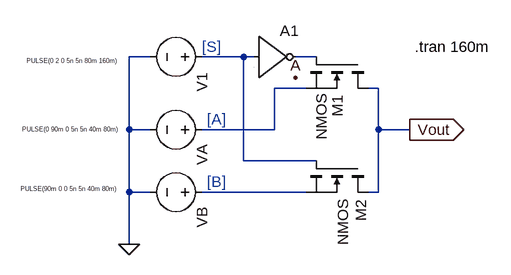
[diagram p0: schematic VLSI_LabInSem.asc]
VLSI_LabInSem.asc, the LTspice schematic file:
Version 4
SHEET 1 880 680
WIRE -64 80 -96 80
WIRE 80 80 16 80
WIRE 96 80 80 80
WIRE 192 80 160 80
WIRE 176 128 128 128
WIRE 288 128 272 128
WIRE -96 192 -96 80
WIRE -64 192 -96 192
WIRE 128 192 128 128
WIRE 128 192 16 192
WIRE 288 192 288 128
WIRE 336 192 288 192
WIRE 80 240 80 80
WIRE 192 240 80 240
WIRE -96 288 -96 192
WIRE -64 288 -96 288
WIRE 176 288 16 288
WIRE 288 288 288 192
WIRE 288 288 272 288
WIRE -96 368 -96 288
FLAG 336 192 Vout
IOPIN 336 192 Out
FLAG -96 368 0
FLAG 160 112 A
SYMBOL nmos 272 80 R90
WINDOW 0 59 47 Left 2
SYMATTR InstName M1
SYMBOL nmos 272 240 R90
WINDOW 0 60 11 Left 2
WINDOW 3 58 39 Left 2
SYMATTR InstName M2
SYMBOL Digital\\inv 96 16 R0
SYMATTR InstName A1
SYMBOL voltage 32 80 R90
WINDOW 3 6 145 VRight 0
WINDOW 123 0 0 Left 0
WINDOW 39 0 0 Left 0
SYMATTR Value PULSE(0 2 0 5n 5n 80m 160m)
SYMATTR InstName V1
SYMBOL voltage 32 288 R90
WINDOW 123 0 0 Left 0
WINDOW 39 0 0 Left 0
WINDOW 3 -5 146 VRight 0
SYMATTR InstName VB
SYMATTR Value PULSE(90m 0 0 5n 5n 40m 80m)
SYMBOL voltage 32 192 R90
WINDOW 123 0 0 Left 0
WINDOW 39 0 0 Left 0
WINDOW 3 -1 144 VRight 0
SYMATTR InstName VA
SYMATTR Value PULSE(0 90m 0 5n 5n 40m 80m)
TEXT 344 64 Left 2 !.tran 160m
TEXT 16 64 Left 2 ;[S]
TEXT 24 176 Left 2 ;[A]
TEXT 24 272 Left 2 ;[B]

The netlist it stands for:
* VLSI_LabInSem.asc
M1 Vout N002 N003 N003 NMOS
M2 Vout N001 N004 N004 NMOS
A1 N001 0 0 0 0 N002 0 0 BUF
V1 N001 0 PULSE(0 2 0 5n 5n 80m 160m)
VB N004 0 PULSE(90m 0 0 5n 5n 40m 80m)
VA N003 0 PULSE(0 90m 0 5n 5n 40m 80m)
.model NMOS NMOS
.model PMOS PMOS
.lib standard.mos
.tran 160m
* [S]
* [A]
* [B]
.backanno
.end